# Altium project T-Type Converter.PrjPcb (part 2 of 2)

## Sheet Switches.SchDoc
size A2
Used 3 times, as channels A, B, C. Parts and nets are listed once, with the designators drawn on the sheet.
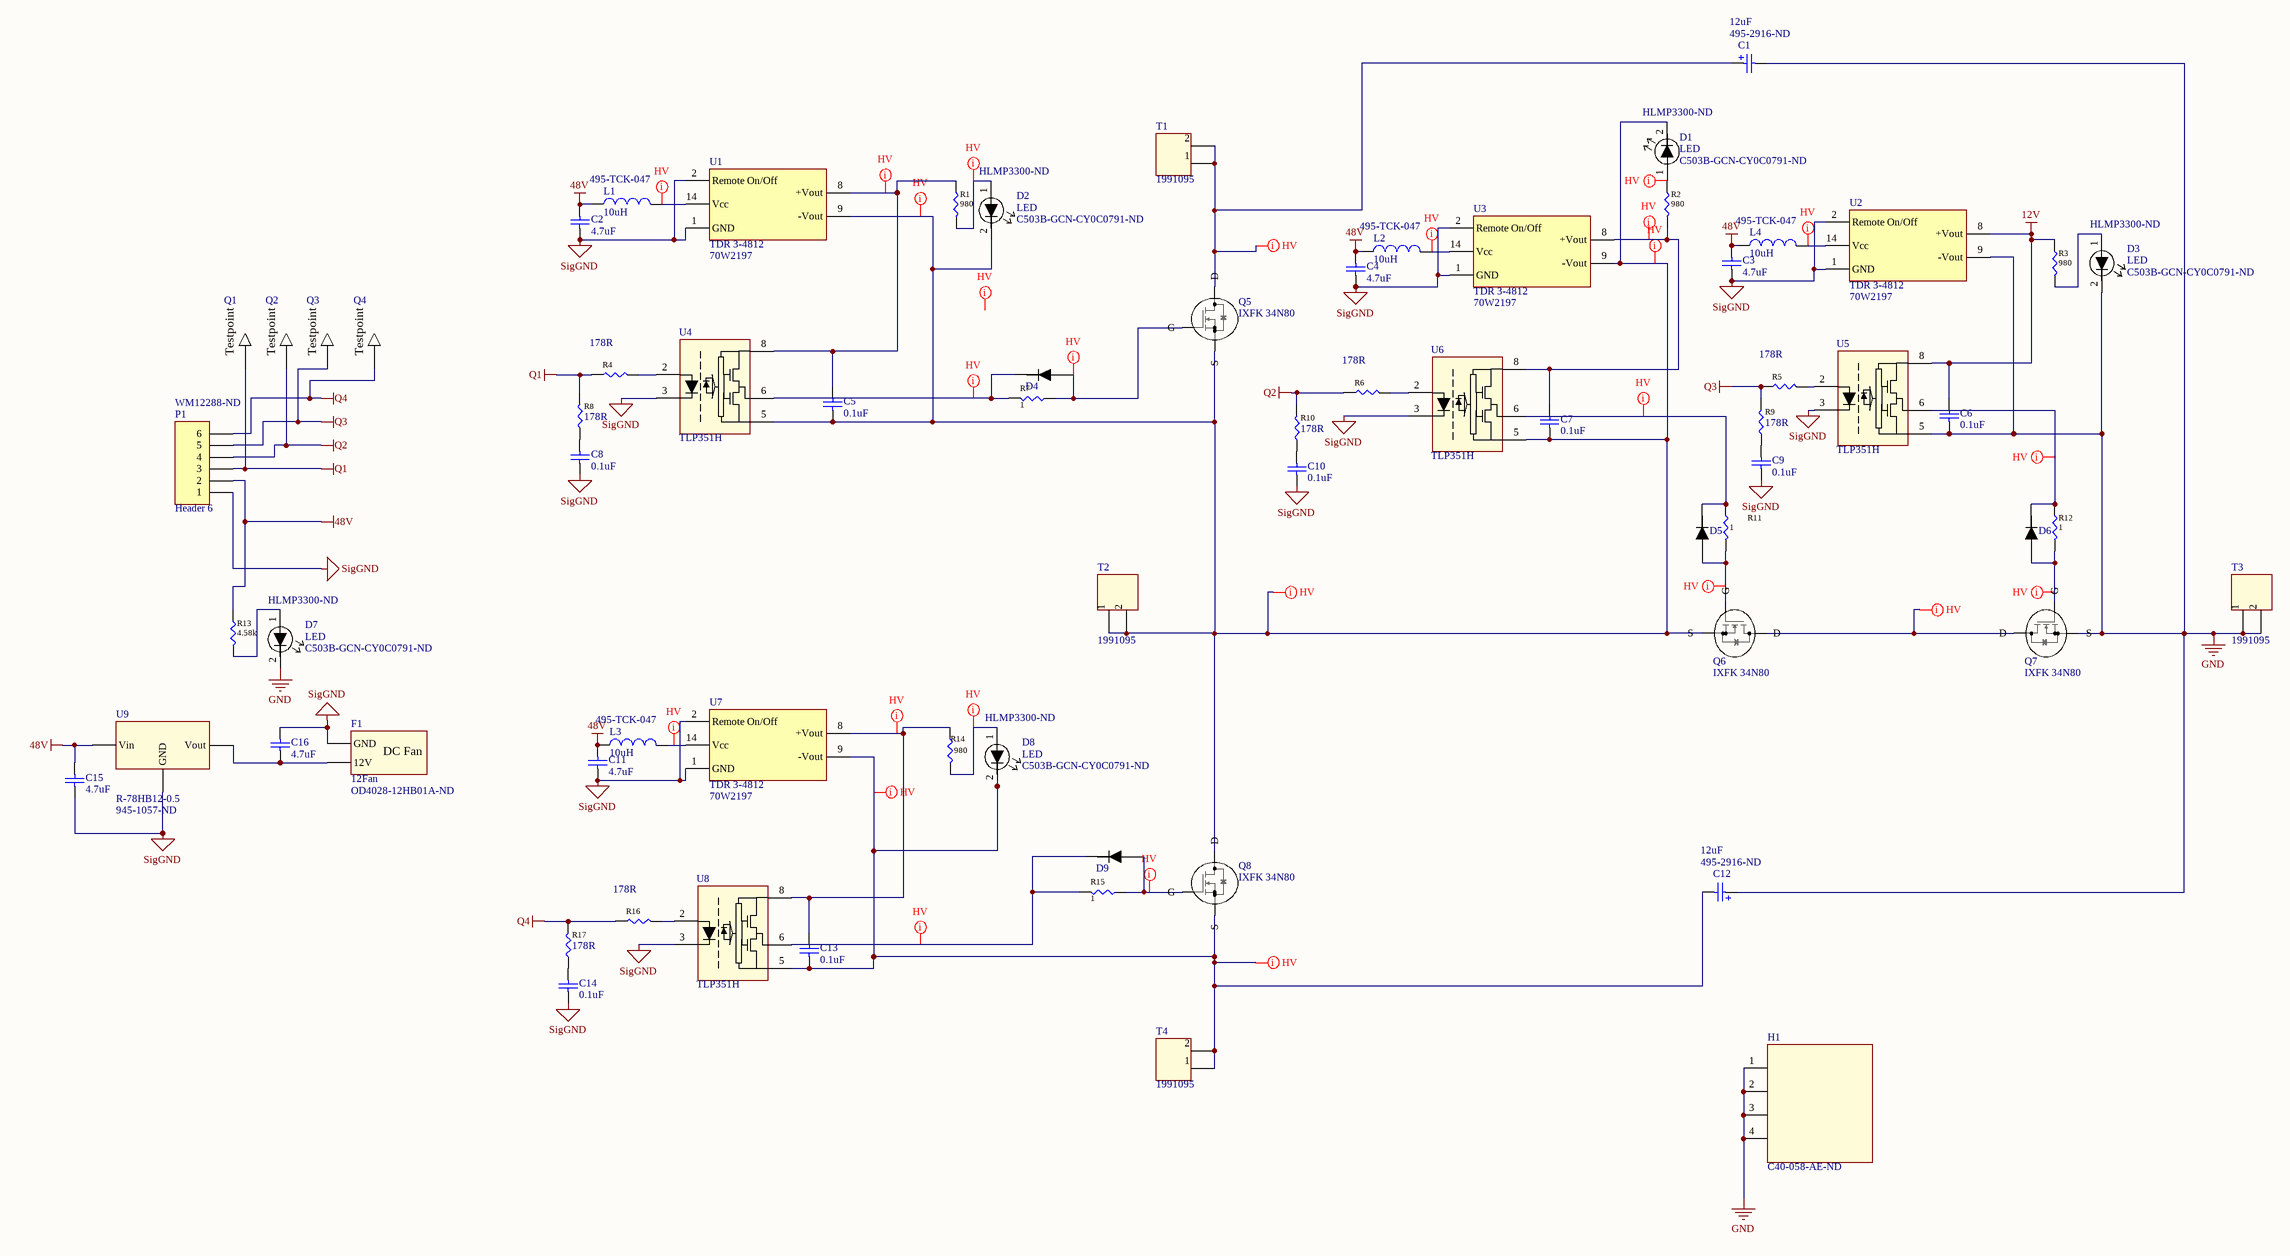
[diagram p2: Switches.SchDoc]

### Parts
C1  Supplier Part Number 1: 495-2916-ND  Capacitance: 12uF  [B32674D3126K000]  (hidden comment: Cap Pol1)
C2  value 4.7uF  [C4532]  (hidden comment: Cap)
C3  value 4.7uF  [C4532]  (hidden comment: Cap)
C4  value 4.7uF  [C4532]  (hidden comment: Cap)
C5  value 0.1uF  [R_1206]  (hidden comment: Cap)
C6  value 0.1uF  [R_1206]  (hidden comment: Cap)
C7  value 0.1uF  [R_1206]  (hidden comment: Cap)
C8  value 0.1uF  [Capacitor 0805 - duplicate]  (hidden comment: Cap)
C9  value 0.1uF  [Capacitor 0805 - duplicate]  (hidden comment: Cap)
C10  value 0.1uF  [Capacitor 0805 - duplicate]  (hidden comment: Cap)
C11  value 4.7uF  [C4532]  (hidden comment: Cap)
C12  Supplier Part Number 1: 495-2916-ND  Capacitance: 12uF  [B32674D3126K000]  (hidden comment: Cap Pol1)
C13  value 0.1uF  [R_1206]  (hidden comment: Cap)
C14  value 0.1uF  [Capacitor 0805 - duplicate]  (hidden comment: Cap)
C15  value 4.7uF  [C4532]  (hidden comment: Cap)
C16  value 4.7uF  [C4532]  (hidden comment: Cap)
D1  LED  Supplier Part Number 1: C503B-GCN-CY0C0791-ND  Supplier Part Number 2: HLMP3300-ND  [LED]
D2  LED  Supplier Part Number 1: C503B-GCN-CY0C0791-ND  Supplier Part Number 2: HLMP3300-ND  [LED]
D3  LED  Supplier Part Number 1: C503B-GCN-CY0C0791-ND  Supplier Part Number 2: HLMP3300-ND  [LED]
D4  1N4148  [DO-35_02]  (value not drawn)
D5  1N4148  [DO-35_02]  (value not drawn)
D6  1N4148  [DO-35_02]  (value not drawn)
D7  LED  Supplier Part Number 1: C503B-GCN-CY0C0791-ND  Supplier Part Number 2: HLMP3300-ND  [LED]
D8  LED  Supplier Part Number 1: C503B-GCN-CY0C0791-ND  Supplier Part Number 2: HLMP3300-ND  [LED]
D9  1N4148  [DO-35_02]  (value not drawn)
F1  12Fan  Supplier Part Number 1: OD4028-12HB01A-ND  [12V Fan]
H1  Supplier Part Number 1: C40-058-AE-ND  [Dual C40]  (hidden comment: Heatsink)
L1  value 10uH  Supplier Part Number 1: 495-TCK-047  [TCK-047]  (hidden comment: Inductor)
L2  value 10uH  Supplier Part Number 1: 495-TCK-047  [TCK-047]  (hidden comment: Inductor)
L3  value 10uH  Supplier Part Number 1: 495-TCK-047  [TCK-047]  (hidden comment: Inductor)
L4  value 10uH  Supplier Part Number 1: 495-TCK-047  [TCK-047]  (hidden comment: Inductor)
P1  Header 6  Supplier Part Number 1: WM12288-ND  [3.00mm Male Header]
Q1  Testpoint  [Testpoint]  (value not drawn)
Q2  Testpoint  [Testpoint]  (value not drawn)
Q3  Testpoint  [Testpoint]  (value not drawn)
Q4  Testpoint  [Testpoint]  (value not drawn)
Q5  IXFK 34N80  [TO-247]
Q6  IXFK 34N80  [TO-247]
Q7  IXFK 34N80  [TO-247]
Q8  IXFK 34N80  [TO-247]
R1  980  [R_1206]
R2  980  [R_1206]
R3  980  [R_1206]
R4  Resistance: 178R  [R_1206]
R5  Resistance: 178R  [R_1206]
R6  Resistance: 178R  [R_1206]
R7  1  [R_1206]
R8  Resistance: 178R  [R_1206]
R9  Resistance: 178R  [R_1206]
R10  Resistance: 178R  [R_1206]
R11  1  [R_1206]
R12  1  [R_1206]
R13  4.58k  [R_1206]
R14  980  [R_1206]
R15  1  [R_1206]
R16  Resistance: 178R  [R_1206]
R17  Resistance: 178R  [R_1206]
T1  1991095  [Terminal Pad]
T2  1991095  [Terminal Pad]
T3  1991095  [Terminal Pad]
T4  1991095  [Terminal Pad]
U1  TDR 3-4812  Supplier Part Number 1: 70W2197  [PID DC-DC Converter - duplicate]
U2  TDR 3-4812  Supplier Part Number 1: 70W2197  [PID DC-DC Converter - duplicate]
U3  TDR 3-4812  Supplier Part Number 1: 70W2197  [PID DC-DC Converter - duplicate]
U4  TLP351H  [11-10C4S]
U5  TLP351H  [11-10C4S]
U6  TLP351H  [11-10C4S]
U7  TDR 3-4812  Supplier Part Number 1: 70W2197  [PID DC-DC Converter - duplicate]
U8  TLP351H  [11-10C4S]
U9  R-78HB12-0.5  Supplier Part Number 1: 945-1057-ND  [R-78HB12-0.5 Footprint]

### Nets
12V: C6.2 R3.2 U2.8(+Vout) U5.8
48V: C2.2 C3.2 C4.2 C11.2 C15.2 L1.1 L2.1 L3.1 L4.1 P1.2 R13.2 U9.1(Vin)
GND: C1.2 C6.1 C12.1 D3.2(Cathode) D7.2(Cathode) H1.1 H1.2 H1.3 H1.4 Q7.3(S) T3.1 T3.2 U2.9(-Vout) U5.5
Q1: P1.3 Q1.1 R4.2 R8.1
Q2: P1.4 Q2.1 R6.2 R10.1
Q3: P1.5 Q3.1 R5.2 R9.1
Q4: P1.6 Q4.1 R16.2 R17.1
SigGND: C2.1 C3.1 C4.1 C8.1 C9.1 C10.1 C11.1 C14.1 C15.1 C16.2 F1.2(GND) P1.1 U1.1(GND) U1.2(Remote_On/Off) U2.1(GND) U2.2(Remote_On/Off) U3.1(GND) U3.2(Remote_On/Off) U4.3 U5.3 U6.3 U7.1(GND) U7.2(Remote_On/Off) U8.3 U9.2(GND)
NetC1_1: C1.1 Q5.2(D) T1.1 T1.2
NetC5_1: C5.1 C7.1 D1.2(Cathode) D2.2(Cathode) Q5.3(S) Q6.3(S) Q8.2(D) T2.1 T2.2 U1.9(-Vout) U3.9(-Vout) U4.5 U6.5
NetC5_2: C5.2 R1.2 U1.8(+Vout) U4.8
NetC7_2: C7.2 R2.1 U3.8(+Vout) U6.8
NetC8_2: C8.2 R8.2
NetC9_2: C9.2 R9.2
NetC10_2: C10.2 R10.2
NetC12_2: C12.2 C13.1 D8.2(Cathode) Q8.3(S) T4.1 T4.2 U7.9(-Vout) U8.5
NetC13_2: C13.2 R14.2 U7.8(+Vout) U8.8
NetC14_2: C14.2 R17.2
NetC16_1: C16.1 F1.1(12V) U9.3(Vout)
NetD1_1: D1.1(Anode) R2.2
NetD2_1: D2.1(Anode) R1.1
NetD3_1: D3.1(Anode) R3.1
NetD4_1: D4.1(Cathode) R7.1 U4.6
NetD4_2: D4.2(Anode) Q5.1(G) R7.2
NetD5_1: D5.1(Cathode) R11.2 U6.6
NetD5_2: D5.2(Anode) Q6.1(G) R11.1
NetD6_1: D6.1(Cathode) R12.2 U5.6
NetD6_2: D6.2(Anode) Q7.1(G) R12.1
NetD7_1: D7.1(Anode) R13.1
NetD8_1: D8.1(Anode) R14.1
NetD9_1: D9.1(Cathode) R15.1 U8.6
NetD9_2: D9.2(Anode) Q8.1(G) R15.2
NetL1_2: L1.2 U1.14(Vcc)
NetL2_2: L2.2 U3.14(Vcc)
NetL3_2: L3.2 U7.14(Vcc)
NetL4_2: L4.2 U2.14(Vcc)
NetQ6_2: Q6.2(D) Q7.2(D)
NetR4_1: R4.1 U4.2
NetR5_1: R5.1 U5.2
NetR6_1: R6.1 U6.2
NetR16_1: R16.1 U8.2

### Channels
A: designators C1=C27_A C2=C28_A C3=C3_A C4=C31_A C5=C5_A C6=C6_A C7=C7_A C8=C8_A C9=C9_A C10=C10_A C11=C36_A C12=C38_A C13=C13_A C14=C14_A C15=C15_A C16=C16_A D1=D1_A#1 D2=D2_A#1 D3=D3_A#1 D4=D1_A#2 D5=D2_A#2 D6=D3_A#2 D7=D7_A D8=D8_A D9=D4_A F1=F1_A H1=H1_A L1=L3_A L2=L5_A L3=L6_A L4=L4_A P1=P1_A Q1=Q1_A#2 Q2=Q2_A#1 Q3=Q3_A#1 Q4=Q4_A#1 Q5=Q1_A#1 Q6=Q2_A#2 Q7=Q3_A#2 Q8=Q4_A#2 R1=R1_A R2=R2_A R3=R3_A R4=R4_A R5=R5_A R6=R6_A R7=R13_A#1 R8=R8_A R9=R9_A R10=R10_A R11=R17_A#1 R12=R18_A R13=R13_A#2 R14=R14_A R15=R19_A R16=R16_A R17=R17_A#2 T1=T1_A T2=T2_A T3=T3_A T4=T4_A U1=U13_A U2=U2_A U3=U15_A U4=U4_A U5=U5_A U6=U6_A U7=U19_A U8=U8_A U9=U9_A
B: designators C1=C27_B C2=C28_B C3=C3_B C4=C31_B C5=C5_B C6=C6_B C7=C7_B C8=C8_B C9=C9_B C10=C10_B C11=C36_B C12=C38_B C13=C13_B C14=C14_B C15=C15_B C16=C16_B D1=D1_B#1 D2=D2_B#1 D3=D3_B#1 D4=D1_B#2 D5=D2_B#2 D6=D3_B#2 D7=D7_B D8=D8_B D9=D4_B F1=F1_B H1=H1_B L1=L3_B L2=L5_B L3=L6_B L4=L4_B P1=P1_B Q1=Q1_B#2 Q2=Q2_B#1 Q3=Q3_B#1 Q4=Q4_B#1 Q5=Q1_B#1 Q6=Q2_B#2 Q7=Q3_B#2 Q8=Q4_B#2 R1=R1_B R2=R2_B R3=R3_B R4=R4_B R5=R5_B R6=R6_B R7=R13_B#1 R8=R8_B R9=R9_B R10=R10_B R11=R17_B#1 R12=R18_B R13=R13_B#2 R14=R14_B R15=R19_B R16=R16_B R17=R17_B#2 T1=T1_B T2=T2_B T3=T3_B T4=T4_B U1=U13_B U2=U2_B U3=U15_B U4=U4_B U5=U5_B U6=U6_B U7=U19_B U8=U8_B U9=U9_B
C: designators C1=C27_C C2=C28_C C3=C3_C C4=C31_C C5=C5_C C6=C6_C C7=C7_C C8=C8_C C9=C9_C C10=C10_C C11=C36_C C12=C38_C C13=C13_C C14=C14_C C15=C15_C C16=C16_C D1=D1_C#1 D2=D2_C#1 D3=D3_C#1 D4=D1_C#2 D5=D2_C#2 D6=D3_C#2 D7=D7_C D8=D8_C D9=D4_C F1=F1_C H1=H1_C L1=L3_C L2=L5_C L3=L6_C L4=L4_C P1=P1_C Q1=Q1_C#2 Q2=Q2_C#1 Q3=Q3_C#1 Q4=Q4_C#1 Q5=Q1_C#1 Q6=Q2_C#2 Q7=Q3_C#2 Q8=Q4_C#2 R1=R1_C R2=R2_C R3=R3_C R4=R4_C R5=R5_C R6=R6_C R7=R13_C#1 R8=R8_C R9=R9_C R10=R10_C R11=R17_C#1 R12=R18_C R13=R13_C#2 R14=R14_C R15=R19_C R16=R16_C R17=R17_C#2 T1=T1_C T2=T2_C T3=T3_C T4=T4_C U1=U13_C U2=U2_C U3=U15_C U4=U4_C U5=U5_C U6=U6_C U7=U19_C U8=U8_C U9=U9_C

### Layout directives
net class HV: (no net found under the mark), NetC5_A_1, NetC5_A_2, NetC7_A_2, NetC13_A_1, NetC13_A_2, NetC27_A_1, NetD1_A#1_1, NetD1_A#2_1, NetD1_A#2_2, NetD2_A#1_1, NetD2_A#2_1, NetD2_A#2_2, NetD3_A#2_1, NetD3_A#2_2, NetD4_A_1, NetD4_A_2, NetD8_A_1, NetL3_A_2, NetL4_A_2, NetL5_A_2, NetL6_A_2, NetQ2_A#2_2

### Notes on the sheet
- (in symbol 12Fan) DC Fan

### Library data of the parts
C1 C12 = Cap Pol1: Polarized Capacitor (Radial); Manufacturer: TDK EPCOS; Dielectric Material: Polypropylene; Tolerance: 10%; ESR (Equivalent Series Resistance): 4mR; Dielectric: PP; Lead Diameter: 0.8mm; Lead Length: 6mm; Published: 8-Jun-2000; LatestRevisionDate: 17-Jul-2002; LatestRevisionNote: Re-released for DXP Platform.; PackageReference: RB7.6-15; Publisher: Altium Limited; PackageDescription: Polarized Capacitor (Radial); 2 Leads; Supplier 1: Digi-Key; Manufacturer Part Number: B32674D3126K000; Stock 1: 17158; Pricing 1: 1=5.33, 10=4.799, 100=3.6259, 500=2.9861, 1000=2.7728, 2500=2.7195 (USD); Case/Package: Radial; Min Operating Temperature: -40°C; Max Operating Temperature: 100°C; Packaging: Bulk; Termination: Radial; Length: 31.5mm; Height: 36.5mm; Lead Pitch: 27.5mm; Depth: 22mm; ComponentLink1URL: http://components.arrow.com/part/dataview/0323_01884664; ComponentLink1Description: http://components.arrow.com/part/dataview/0323_01884664
C2-C4 C11 C15 C16 = Cap: Capacitor; Manufacturer: TDK; Manufacturer Part Number: CGA8N3X7S2A475K230KB; Tolerance: 10%; Voltage Rating: 100V; Dielectric: X7S; Published: 8-Jun-2000; LatestRevisionDate: 17-Jul-2002; LatestRevisionNote: Re-released for DXP Platform.; PackageReference: RAD-0.3; Publisher: Altium Limited; PackageDescription: Radial Cap, Thru-Hole; 2 Leads; 0.3 in Pin Spacing; Supplier 1: Digi-Key; Supplier Part Number 1: 445-7923-1-ND; Stock 1: 236; Pricing 1: 1=1.92, 10=1.518, 100=1.1385 (USD); Case/Package: 1812; Weight: 0.000952oz; Case Code (Metric): 4532; Case Code (Imperial): 1812; Min Operating Temperature: -55°C; Max Operating Temperature: 125°C; Packaging: Tape and Reel; Capacitance: 4.7uF; Termination: SMD/SMT; Package Quantity: 1; Voltage Rating (DC): 100V; Composition: Ceramic; Length: 4.5mm; Height: 1.6mm; Width: 0.126inch; Thickness: 0.091inch; Depth: 3.2mm; REACH SVHC: No SVHC; ComponentLink1URL: https://datasheet.ciiva.com/24217/cga8n3x7s2a475k230kb-266118-24217101.pdf; ComponentLink1Description: https://datasheet.ciiva.com/24217/cga8n3x7s2a475k230kb-266118-24217101.pdf
C5-C10 C13 C14 = Cap: Capacitor; Published: 8-Jun-2000; LatestRevisionDate: 17-Jul-2002; LatestRevisionNote: Re-released for DXP Platform.; PackageReference: RAD-0.3; Publisher: Altium Limited; PackageDescription: Radial Cap, Thru-Hole; 2 Leads; 0.3 in Pin Spacing
D1-D3 D7 D8 = LED: Manufacturer: Cree; Manufacturer Part Number: C503B-GCN-CY0C0791; Colour: Green; Lens Colour: Clear,Colorless; Viewing Angle: 30°; Lens Style: Dome,Round; Luminous Intensity: 12.5cd; Forward Voltage: 3.2V; Wavelength: 535nm; Forward Current: 20mA; Lens Transparency: Clear; Dominant Wavelength: 527nm; Number of Elements: 1; Power Dissipation: 120mW; Supplier 1: Digi-Key; Stock 1: 14930; Pricing 1: 1=0.24, 10=0.227, 100=0.2098, 1000=0.1877, 50000=0.1743 (USD); Mount: Through Hole; Case/Package: Radial; Number of Pins: 2; Weight: 0.01lb; Min Operating Temperature: -40°C; Max Operating Temperature: 95°C; Packaging: Bulk; Illumination Colour: Green; Test Current: 20mA; Number of LEDs: 1; Length: 5.8mm; Height: 8.8mm; Depth: 5.8mm; Width: 0.5inch; Radiation Hardening: No; REACH SVHC: Unknown; ComponentLink1URL: https://datasheet.ciiva.com/2111/c503b+bas+ban+bcs+bcn+gas+gan+gcs+gcn+1094-2111680.pdf; ComponentLink1Description: https://datasheet.ciiva.com/2111/c503b+bas+ban+bcs+bcn+gas+gan+gcs+gcn+1094-2111680.pdf; ComponentLink2URL: https://datasheet.ciiva.com/15210/getdatasheetpartid-314292-15210341.pdf; ComponentLink2Description: https://datasheet.ciiva.com/15210/getdatasheetpartid-314292-15210341.pdf; ComponentLink3URL: https://datasheet.ciiva.com/18319/25-4952-18319333.pdf; ComponentLink3Description: https://datasheet.ciiva.com/18319/25-4952-18319333.pdf; ComponentLink4URL: https://datasheet.ciiva.com/1331/1604976-1331801.pdf; ComponentLink4Description: https://datasheet.ciiva.com/1331/1604976-1331801.pdf; ComponentLink5URL: https://datasheet.ciiva.com/8076/c503bbasbanbcsbcngasgangcsgcn1094-8076249.pdf; ComponentLink5Description: https://datasheet.ciiva.com/8076/c503bbasbanbcsbcngasgangcsgcn1094-8076249.pdf; Supplier 2: Digi-Key; Stock 2: 0; Package Quantity: 5000; Lead Free: Lead Free; ComponentLink6URL: https://datasheet.ciiva.com/2121/hlmp-3300-01-15-16-2121755.pdf; ComponentLink6Description: https://datasheet.ciiva.com/2121/hlmp-3300-01-15-16-2121755.pdf
D4-D6 D9 = 1N4148: Diode; Manufacturer: Fairchild Semiconductor; Forward Voltage: 1V; Reverse Recovery Time: 4ns; Element Configuration: Single; Polarity: Standard; Current Rating: 200mA; Capacitance: 4pF; Voltage Rating (DC): 100V; Peak Non-Repetitive Surge Current: 4A; Max Forward Surge Current (Ifsm): 1A; Max Power Dissipation: 500mW; Peak Reverse Current: 5uA; Outside Diameter: 1.85mm; Supplier 1: Digi-Key; Manufacturer Part Number: 1N4148; Stock 1: 0; Pricing 1: 25=4 (USD); Mount: Through Hole; Number of Pins: 2; Weight: 0.01lb; Contact Plating: Tin; Min Operating Temperature: -65°C; Max Operating Temperature: 175°C; Packaging: Bulk; Output Current: 200mA; Forward Current: 200mA; Max Repetitive Reverse Voltage (Vrrm): 100V; Package Quantity: 2000; Recovery Time: 4ns; Max Surge Current: 4A; Reverse Voltage (DC): 100V; Average Rectified Current: 200mA; Power Dissipation: 500mW; Diameter: 1.91mm; Length: 4.56mm; Height: 4.56mm; Width: 1.91mm; Radiation Hardening: No; Lead Free: Lead Free; REACH SVHC: No SVHC; ComponentLink1URL: https://datasheet.ciiva.com/910/1n914-910546.pdf; ComponentLink1Description: https://datasheet.ciiva.com/910/1n914-910546.pdf; ComponentLink2URL: https://datasheet.ciiva.com/1242/1716967-1242233.pdf; ComponentLink2Description: https://datasheet.ciiva.com/1242/1716967-1242233.pdf; ComponentLink3URL: https://datasheet.ciiva.com/3304/fdll914b-3304217.pdf; ComponentLink3Description: https://datasheet.ciiva.com/3304/fdll914b-3304217.pdf; ComponentLink4URL: https://datasheet.ciiva.com/25951/fdll914b-25951516.pdf; ComponentLink4Description: https://datasheet.ciiva.com/25951/fdll914b-25951516.pdf; ComponentLink5URL: https://datasheet.ciiva.com/27049/743285-27049708.pdf; ComponentLink5Description: https://datasheet.ciiva.com/27049/743285-27049708.pdf; ComponentLink6URL: https://datasheet.ciiva.com/16740/1n4148-16740829.pdf; ComponentLink6Description: https://datasheet.ciiva.com/16740/1n4148-16740829.pdf; Supplier Part Number 1: 1N4148-DIE-ND
F1 = 12Fan: Manufacturer: Knight Electronics Orion; Manufacturer Part Number: OD4028-12HB01A; Current Rating: 200mA; Airflow: 12CFM; RPM: 8800RPM; Bearing Type: Ball; Voltage Rating: 12V; Power Consumption: 2.64W; Noise Level: 37dB; Noise: 37dBA; Supplier 1: Digi-Key; Stock 1: 0; Pricing 1: 520=10.5105 (USD); Case/Package: Axial; Min Operating Temperature: -4°C; Max Operating Temperature: 176°C; Package Quantity: 40; Termination: 3 Wire Leads; Operating Supply Voltage: 12V; Height: 40mm; Width: 28mm; Depth: 28mm; Lead Free: Lead Free; ComponentLink1URL: https://datasheet.ciiva.com/1001/part-number-construction-guide-1001713.pdf; ComponentLink1Description: https://datasheet.ciiva.com/1001/part-number-construction-guide-1001713.pdf; ComponentLink2URL: https://datasheet.ciiva.com/16472/od4028-16472707.pdf; ComponentLink2Description: https://datasheet.ciiva.com/16472/od4028-16472707.pdf
H1 = C-40 Heatsink: Dual C-40 Heatsink; Manufacturer: Ohmite; Manufacturer Part Number: C40-058-AE; Shape: Fins,Rectangular; Supplier 1: Digi-Key; Stock 1: 482; Pricing 1: 1=6.75, 10=6.57, 25=6.2052, 50=5.84, 100=5.475, 250=5.11, 500=4.745, 1000=4.6538 (USD); Mount: Clip; Case/Package: TO-247; Colour: Black,Silver; Material: Aluminium; Package Quantity: 1; Packaging: Bulk; Length: 58mm; Height: 43.8mm; Width: 32mm; Height Off Base: 1.26inch; REACH SVHC: Unknown; ComponentLink1URL: https://datasheet.ciiva.com/24006/sink-c40-253256-24006193.pdf; ComponentLink1Description: https://datasheet.ciiva.com/24006/sink-c40-253256-24006193.pdf; ComponentLink2URL: https://datasheet.ciiva.com/17118/70290407-17118119.pdf; ComponentLink2Description: https://datasheet.ciiva.com/17118/70290407-17118119.pdf; ComponentLink3URL: https://datasheet.ciiva.com/46412/sink-c40-46412139.pdf; ComponentLink3Description: https://datasheet.ciiva.com/46412/sink-c40-46412139.pdf
L1-L4 = Inductor: Manufacturer: Traco Power; Code_IEC: 1005; Tolerance: 20%; DC Resistance (DCR): 100mR; Test Frequency: 1KHz; DC Current: 1.44A; Published: 8-Jun-2000; LatestRevisionDate: 29-May-2009; LatestRevisionNote: IPC-7351 Footprint Added.; PackageReference: 0402-A; Publisher: Altium Limited; PackageDescription: Chip Inductor; Code_JEITA: 0402; Supplier 1: Mouser; Manufacturer Part Number: TCK-047; Stock 1: 23; Pricing 1: 1=2.52, 10=2.48, 50=2.33, 100=2.33, 1000=2.33, 10000=2.33 (USD); Case/Package: SMD/SMT; Military Standard: Not; Inductance: 10uh; Impedance: 100mR; Current Rating: 1.44A; Length: 6.1mm; Depth: 5.5mm; REACH SVHC: No SVHC; ComponentLink1URL: http://components.arrow.com/part/dataview/0323_04115114; ComponentLink1Description: http://components.arrow.com/part/dataview/0323_04115114; ComponentLink2URL: http://www.farnell.com/datasheets/2062539.pdf; ComponentLink2Description: http://www.farnell.com/datasheets/2062539.pdf
P1 = Header 6: Header, 6-Pin; Manufacturer: Molex; Manufacturer Part Number: 0559320610; Number of Positions: 6; Connector Type: Male Pin; Pitch: 2mm; LatestRevisionDate: 17-Jul-2002; LatestRevisionNote: Re-released for DXP Platform.; Publisher: Altium Limited; Supplier 1: Digi-Key; Stock 1: 5638; Pricing 1: 1=0.53, 10=0.497, 100=0.3811, 500=0.3314, 1000=0.2734, 5000=0.2403, 10000=0.2237 (USD); Mount: Through Hole; Housing Material: Polyester; Contact Plating: Tin; Colour: Natural; Housing Colour: Natural; Min Operating Temperature: -25°C; Max Operating Temperature: 85°C; Packaging: Tray; Number of Rows: 1; Termination: Solder; Orientation: Straight; Package Quantity: 3200; Number of Contacts: 6; Fastening Type: Latch; Length: 16mm; Depth: 6.7mm; Contact Mating Length: 0.144inch; ComponentLink1URL: https://datasheet.ciiva.com/2943/559320310-sd-2943088.pdf; ComponentLink1Description: https://datasheet.ciiva.com/2943/559320310-sd-2943088.pdf; ComponentLink2URL: https://datasheet.ciiva.com/10086/0559320610-pcb-headers-10086524.pdf; ComponentLink2Description: https://datasheet.ciiva.com/10086/0559320610-pcb-headers-10086524.pdf
Q5-Q8 = IXFK 34N80: MOSFET 34A; Manufacturer: IXYS; Rise Time: 45ns; Rds On Max: 240mR; Input Capacitance: 7.5nF; Recovery Time: 250ns; Drain to Source Breakdown Voltage: 800V; Fall Time: 40ns; Power Dissipation: 560W; Turn-Off Delay Time: 100ns; Element Configuration: Single; Gate to Source Voltage (Vgs): 20V; Supplier 1: Digikey; Manufacturer Part Number: IXFK34N80; Stock 1: 25; Pricing 1: 1=22.64, 10=20.94, 25=19.2424, 100=17.884, 250=16.4126 (USD); Case/Package: TO-264-3; Min Operating Temperature: -55°C; Max Operating Temperature: 150°C; Package Quantity: 25; Packaging: Rail/Tube; Continuous Drain Current (ID): 34A; Drain to Source Resistance: 240mR; Drain to Source Voltage (Vdss): 800V; Max Power Dissipation: 560W; Current Rating: 34A; Voltage Rating (DC): 800V; Lead Free: Lead Free; ComponentLink1URL: https://datasheet.ciiva.com/4446/98560-63299-4446514.pdf; ComponentLink1Description: https://datasheet.ciiva.com/4446/98560-63299-4446514.pdf; ComponentLink2URL: https://datasheet.ciiva.com/16298/98560-16298076.pdf; ComponentLink2Description: https://datasheet.ciiva.com/16298/98560-16298076.pdf; ComponentLink3URL: https://datasheet.ciiva.com/940/98560-940430.pdf; ComponentLink3Description: https://datasheet.ciiva.com/940/98560-940430.pdf; ComponentLink4URL: https://datasheet.ciiva.com/14110/tb612985-e-14110030.pdf; ComponentLink4Description: https://datasheet.ciiva.com/14110/tb612985-e-14110030.pdf; ComponentLink5URL: https://datasheet.ciiva.com/26791/ixfk34n80-26791415.pdf; ComponentLink5Description: https://datasheet.ciiva.com/26791/ixfk34n80-26791415.pdf; Supplier Part Number 1: IXFK34N80-ND
R1-R3 R7 R11-R15 = RES_SMD1: RES SMD 1% 1/4W 1206; Manufacturer: Panasonic Electronic Components; Manufacturer Part Number: ERJ-8ENF9101V; Power (Watts): 0.25W, 1/4W; Temperature Coefficient: ±100ppm/°C; Supplier 1: Digi-Key; RoHS: RoHS Compliant; Category: Resistors; Stock 1: 17632; Pricing 1: 1=0.15, 50=0.0424, 100=0.0313, 250=0.02384, 500=0.01908, 1000=0.01404 (CAD); Packaging: Digi-Reel®; Part Status: Active; Tolerance: ±1%; Composition: Thick Film; Features: Automotive AEC-Q200; Operating Temperature: -55°C ~ 155°C; Package / Case: 1206 (3216 Metric); Supplier Device Package: 1206; Size / Dimension: 0.126" L x 0.063" W (3.20mm x 1.60mm); Height: 0.028" (0.70mm); Number of Terminations: 2; Failure Rate: -; ComponentLink1URL: http://industrial.panasonic.com/www-cgi/jvcr13pz.cgi?E+PZ+3+AOA0002+ERJ8ENF9101V+7+WW; ComponentLink1Description: http://industrial.panasonic.com/www-cgi/jvcr13pz.cgi?E+PZ+3+AOA0002+ERJ8ENF9101V+7+WW; Supplier Part Number 1: P9.10KFDKR-ND
  R1-R3 R14: Value: 980
  R7 R11 R12 R15: Value: 1
  R13: Value: 4.58k
R4-R6 R8-R10 R16 R17 = RES_SMD1: RES SMD 1% 1/4W 1206; Manufacturer: Panasonic ECG; Manufacturer Part Number: ERJ-8ENF1780V; Temperature Coefficient: 100ppm/°C; Power Rating: 250mW; Voltage Rating: 200V; Supplier 1: Digi-Key; Supplier Part Number 1: P178FCT-ND; Stock 1: 69740; Pricing 1: 1=0.11, 10=0.097, 100=0.0373, 1000=0.0164, 2500=0.0142 (USD); Mount: Surface Mount; Case/Package: 1206; Contact Plating: Tin; Case Code (Imperial): 1206; Case Code (Metric): 3216; Min Operating Temperature: -55°C; Max Operating Temperature: 155°C; Tolerance: 1%; Composition: Thick Film; Packaging: Tape and Reel; Package Quantity: 5000; Termination: SMD/SMT; Number of Terminations: 2; Military Standard: Not; Max Power Dissipation: 250mW; Voltage Rating (DC): 200V; Length: 3.2mm; Height: 0.028inch; Width: 1.6mm; Depth: 1.6mm; Radiation Hardening: No; REACH SVHC: Yes; Lead Free: Contains Lead; ComponentLink1URL: https://datasheet.ciiva.com/46444/1678782-46444661.pdf; ComponentLink1Description: https://datasheet.ciiva.com/46444/1678782-46444661.pdf; ComponentLink2URL: https://datasheet.ciiva.com/17207/aoa0000ce2-17207240.pdf; ComponentLink2Description: https://datasheet.ciiva.com/17207/aoa0000ce2-17207240.pdf; ComponentLink3URL: https://datasheet.ciiva.com/24071/aoa0000ce2-24071720.pdf; ComponentLink3Description: https://datasheet.ciiva.com/24071/aoa0000ce2-24071720.pdf; ComponentLink4URL: https://datasheet.ciiva.com/30060/aoa0000ce2-30060360.pdf; ComponentLink4Description: https://datasheet.ciiva.com/30060/aoa0000ce2-30060360.pdf; ComponentLink5URL: https://datasheet.ciiva.com/22674/1678782-22674332.pdf; ComponentLink5Description: https://datasheet.ciiva.com/22674/1678782-22674332.pdf; ComponentLink6URL: https://datasheet.ciiva.com/22741/1678782-22741180.pdf; ComponentLink6Description: https://datasheet.ciiva.com/22741/1678782-22741180.pdf
T1-T4 = Terminal Block 2: 2 way terminal block; Manufacturer: Phoenix Contact; Colour: Green; Number of Contacts: 2; Wire Gauge (Max): 24AWG; Wire Gauge (Min): 12AWG; Voltage Rating: 400V; Current Rating: 24A; Number of Levels: 1; Current: 20A; Voltage: 300V; Pitch: 5mm; Approvals: UL; Supplier 1: Digi-Key; Manufacturer Part Number: 1991095; Stock 1: 1914; Pricing 1: 1=1.13, 10=1.078, 50=1.0486, 100=0.98, 250=0.9016, 500=0.833, 1000=0.7938, 2500=0.7448 (USD); Mount: Through Hole; Weight: 0.102294oz; Housing Colour: Green; Housing Material: Nylon; Termination: Screwless; Package Quantity: 100; Packaging: Bulk; Number of Poles: 2; Number of Positions Per Level: 2; Number of Positions: 2; Number of Rows: 1; Max Current Rating: 24A; Number of Circuits: 2; Orientation: Straight; Length: 11.4mm; Width: 14.4mm; Depth: 13.5mm; Lead Free: Lead Free; ComponentLink1URL: https://datasheet.ciiva.com/6752/1991095-6752880.pdf; ComponentLink1Description: https://datasheet.ciiva.com/6752/1991095-6752880.pdf; ComponentLink2URL: https://datasheet.ciiva.com/16051/1991095-16051374.pdf; ComponentLink2Description: https://datasheet.ciiva.com/16051/1991095-16051374.pdf; ComponentLink3URL: https://datasheet.ciiva.com/29222/774864-da-01-en-printklemme-1991095-100-st-29222380.pdf; ComponentLink3Description: https://datasheet.ciiva.com/29222/774864-da-01-en-printklemme-1991095-100-st-29222380.pdf; Supplier Part Number 1: 277-6267-ND
U1-U3 U7 = TDR 3-4812: 48V-12V Converter; Manufacturer: Traco Power; Manufacturer Part Number: TDR3-4812WI; Nominal Input Voltage: 48V; Output Voltage: 12V; Output Current: 250mA; Number of Outputs: 1; Efficiency: 81%; Min Input Voltage: 36V; Max Input Voltage: 75V; Min Input Voltage (DC): 18V; Isolation Voltage: 1.5kV; Max Output Power: 3W; Supplier 1: Newark; Stock 1: 0; Min Operating Temperature: -40°C; Max Operating Temperature: 85°C; Nominal Output Voltage: 12V; Max Output Current: 250mA; Max Input Voltage (DC): 75V; Voltage - Output 1: 12V; Current - Output 1: 250mA; Length: 18.9mm; Height: 8.7mm; Width: 12.8mm; Depth: 18.9mm; REACH SVHC: No SVHC; ComponentLink1URL: https://datasheet.ciiva.com/7625/1763545-7625255.pdf; ComponentLink1Description: https://datasheet.ciiva.com/7625/1763545-7625255.pdf; ComponentLink2URL: https://datasheet.ciiva.com/3356/tdr3wi-eng-tds-3356635.pdf; ComponentLink2Description: https://datasheet.ciiva.com/3356/tdr3wi-eng-tds-3356635.pdf; ComponentLink3URL: https://datasheet.ciiva.com/26336/157237-da-01-de-dc-dc-wandler-tdr-3-4812wi-26336242.pdf; ComponentLink3Description: https://datasheet.ciiva.com/26336/157237-da-01-de-dc-dc-wandler-tdr-3-4812wi-26336242.pdf
U4-U6 U8 = TLP351H: Photocoupler Driver; Manufacturer: Toshiba; Number of Channels: 1; Isolation Voltage: 3.75kV; Supplier 1: Newark; Manufacturer Part Number: TLP351H; Stock 1: 544; Case/Package: DIP; Number of Pins: 8; REACH SVHC: Unknown; ComponentLink1URL: http://www.farnell.com/datasheets/2017846.pdf; ComponentLink1Description: http://www.farnell.com/datasheets/2017846.pdf; Supplier Part Number 1: 78Y6824
U9 = R-78HB12-0.5: Manufacturer: Recom; Number of Outputs: 1; Efficiency: 94%; Max Power Dissipation: 6W; Max Output Voltage: 12V; Max Input Voltage: 72V; Min Input Voltage: 17V; Output Current: 500mA; Nominal Input Voltage: 48V; Isolation Voltage: 3kV; Isolation: Non-Isolated; Supplier 1: Digi-Key; Manufacturer Part Number: R-78HB12-0.5; Stock 1: 893; Pricing 1: 1=13.02, 5=12.92, 10=12.821, 25=12.624, 50=12.2296, 100=11.046, 250=10.8488, 500=10.6515 (USD); Mount: Through Hole,PCB; Case/Package: SIP; Weight: 4g; Min Operating Temperature: -40°C; Max Operating Temperature: 85°C; Packaging: Rail/Tube; Output Voltage: 12V; Min Input Voltage (DC): 17V; Max Input Voltage (DC): 72V; Max Output Current: 500mA; Nominal Output Voltage: 12V; Package Quantity: 42; Voltage - Output 1: 12V; Power Rating: 6W; Current - Output 1: 500mA; Output Power: 6W; Max Output Power: 6W; Length: 11.5mm; Height: 17.5mm; Width: 8.5mm; Depth: 11.5mm; Lead Free: Lead Free; REACH SVHC: No SVHC; ComponentLink1URL: https://datasheet.ciiva.com/2374/r-78hbxx-0-5-l-2374160.pdf; ComponentLink1Description: https://datasheet.ciiva.com/2374/r-78hbxx-0-5-l-2374160.pdf; ComponentLink2URL: https://datasheet.ciiva.com/4119/46860097s8433187n1223-4119049.pdf; ComponentLink2Description: https://datasheet.ciiva.com/4119/46860097s8433187n1223-4119049.pdf; ComponentLink3URL: https://datasheet.ciiva.com/3355/zlr-78hbxx-0-5-3355834.pdf; ComponentLink3Description: https://datasheet.ciiva.com/3355/zlr-78hbxx-0-5-3355834.pdf; ComponentLink4URL: https://datasheet.ciiva.com/16479/r-78hbxx-0-5-l-16479786.pdf; ComponentLink4Description: https://datasheet.ciiva.com/16479/r-78hbxx-0-5-l-16479786.pdf; ComponentLink5URL: https://datasheet.ciiva.com/11836/0900766b80aba023-11836814.pdf; ComponentLink5Description: https://datasheet.ciiva.com/11836/0900766b80aba023-11836814.pdf; ComponentLink6URL: https://datasheet.ciiva.com/29184/155001-da-01-en-dc-dc-wandler-29184381.pdf; ComponentLink6Description: https://datasheet.ciiva.com/29184/155001-da-01-en-dc-dc-wandler-29184381.pdf

## Sheet Signals.SchDoc
size A2
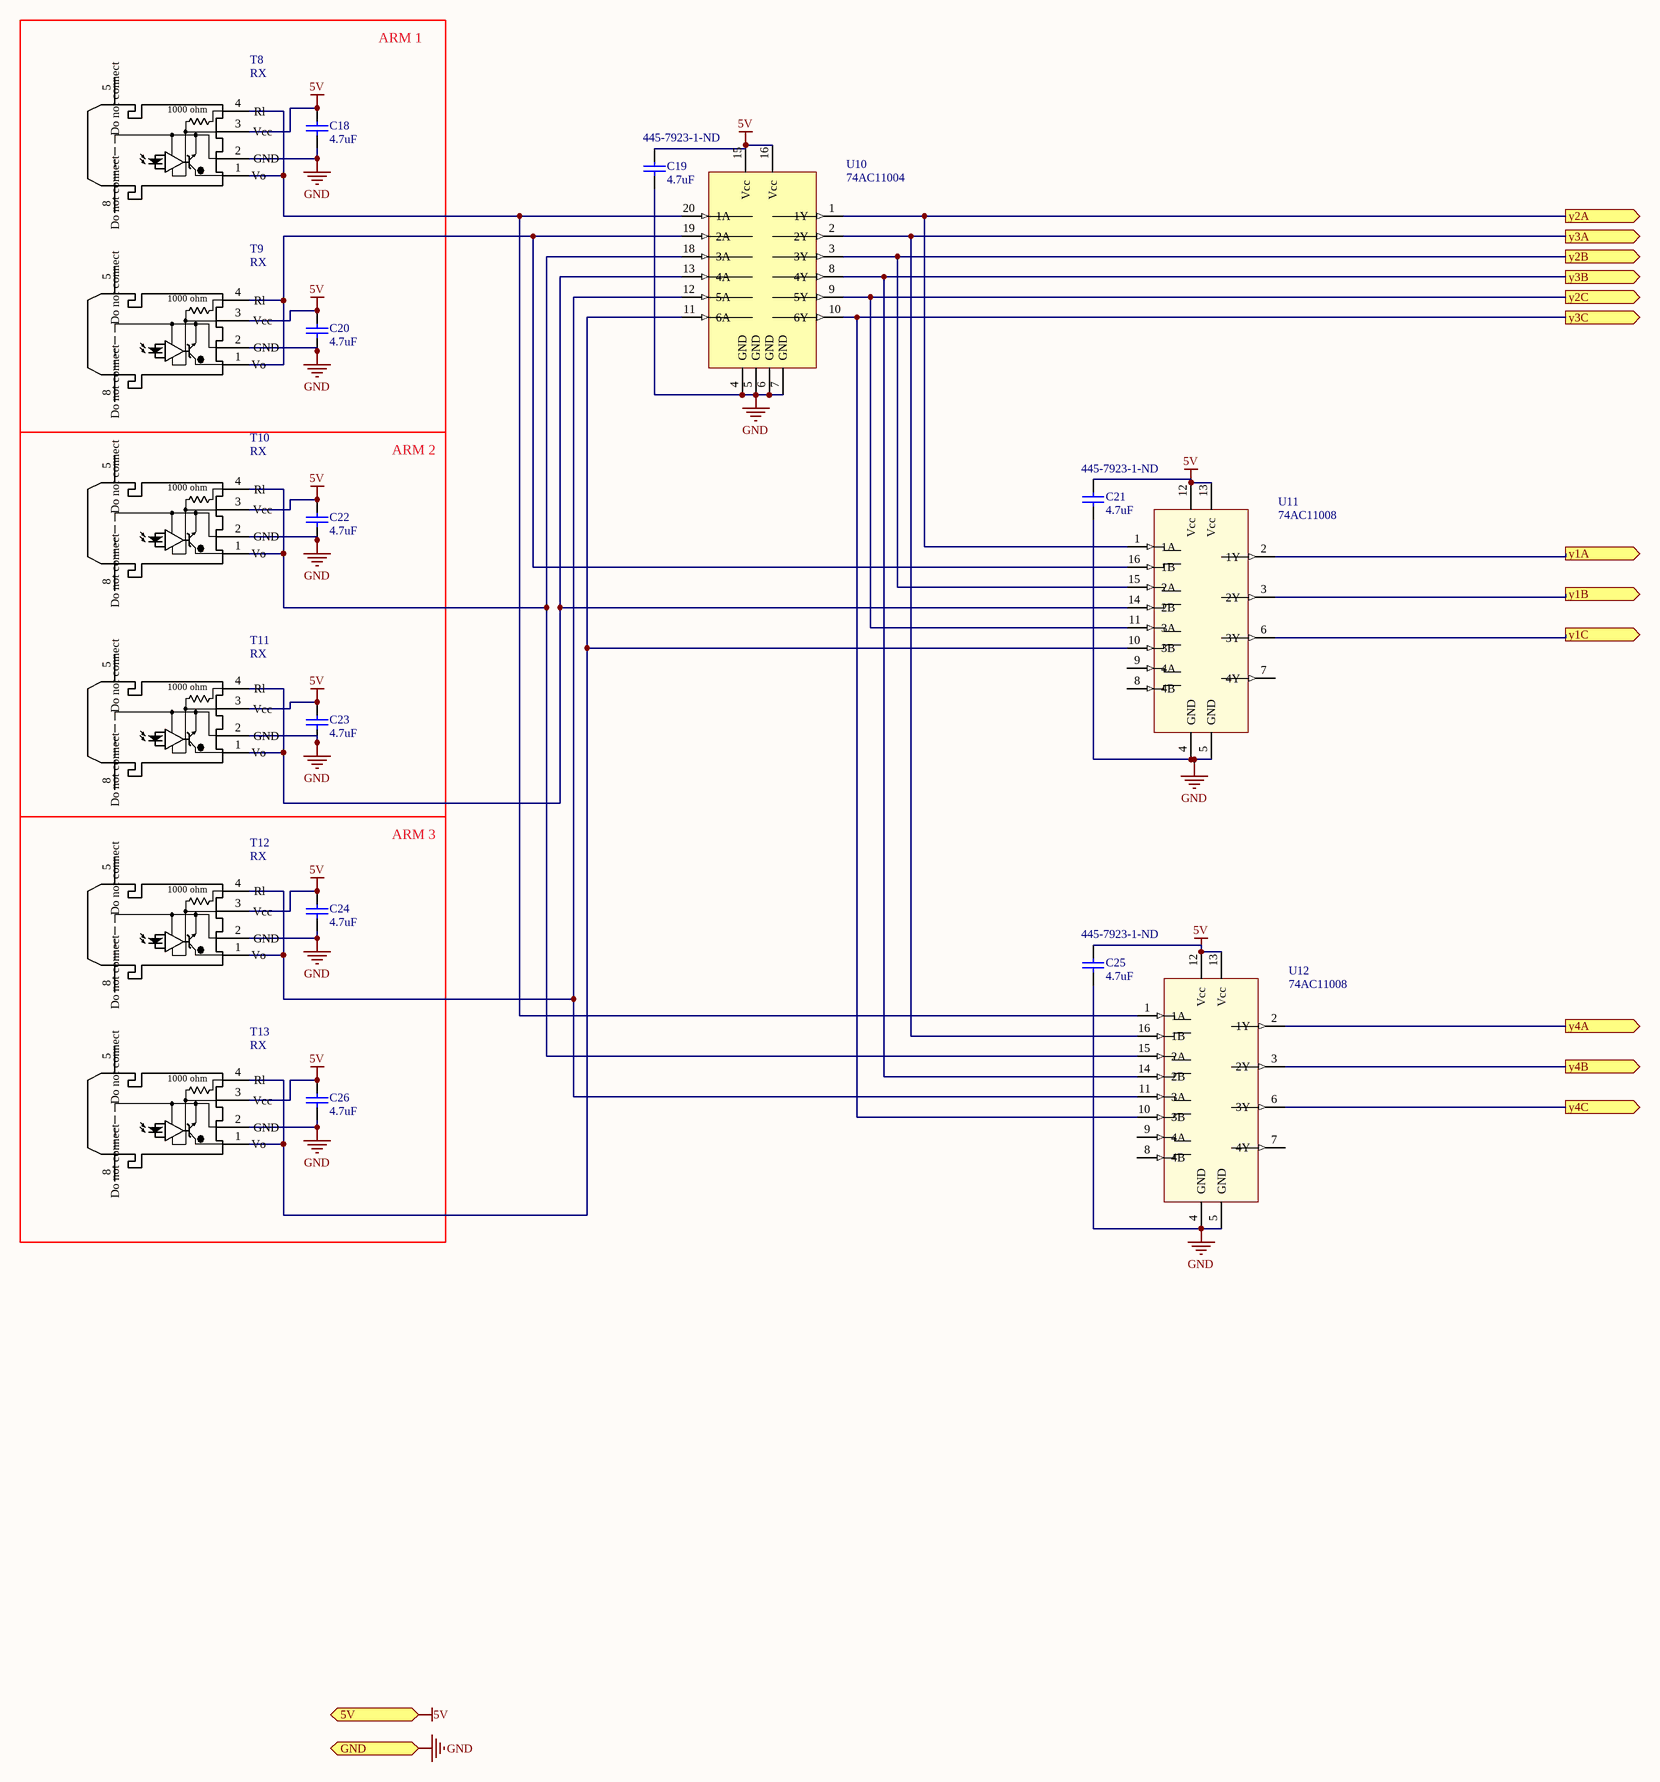
[diagram p3: Signals.SchDoc]

### Parts
C18  value 4.7uF  [C4532]  (hidden comment: Cap)
C19  value 4.7uF  Supplier Part Number 1: 445-7923-1-ND  [C4532]  (hidden comment: Cap)
C20  value 4.7uF  [C4532]  (hidden comment: Cap)
C21  value 4.7uF  Supplier Part Number 1: 445-7923-1-ND  [C4532]  (hidden comment: Cap)
C22  value 4.7uF  [C4532]  (hidden comment: Cap)
C23  value 4.7uF  [C4532]  (hidden comment: Cap)
C24  value 4.7uF  [C4532]  (hidden comment: Cap)
C25  value 4.7uF  Supplier Part Number 1: 445-7923-1-ND  [C4532]  (hidden comment: Cap)
C26  value 4.7uF  [C4532]  (hidden comment: Cap)
T8  RX  [Optics]
T9  RX  [Optics]
T10  RX  [Optics]
T11  RX  [Optics]
T12  RX  [Optics]
T13  RX  [Optics]
U10  74AC11004  [R-PDIP-T20]
U11  74AC11008  [R-PDIP-T16]
U12  74AC11008  [R-PDIP-T16]

### Blocks framed on the sheet
ARM 1: C18 C20 T8 T9
ARM 2: C22 C23 T10 T11
ARM 3: C24 C26 T12 T13

### Ports
5V, GND, y1A (out), y1B (out), y1C (out), y2A (out), y2B (out), y2C (out), y3A (out), y3B (out), y3C (out), y4A (out), y4B (out), y4C (out)

### Nets
5V: C18.2 C19.2 C20.2 C21.2 C22.2 C23.2 C24.2 C25.2 C26.2 T8.3(Vcc) T9.3(Vcc) T10.3(Vcc) T11.3(Vcc) T12.3(Vcc) T13.3(Vcc) U10.15(Vcc) U10.16(Vcc) U11.12(Vcc) U11.13(Vcc) U12.12(Vcc) U12.13(Vcc) ; port 5V
GND: C18.1 C19.1 C20.1 C21.1 C22.1 C23.1 C24.1 C25.1 C26.1 T8.2(GND) T9.2(GND) T10.2(GND) T11.2(GND) T12.2(GND) T13.2(GND) U10.4(GND) U10.5(GND) U10.6(GND) U10.7(GND) U11.4(GND) U11.5(GND) U12.4(GND) U12.5(GND) ; port GND
NetS1_13: U11.6(3Y) ; port y1C
NetS1_14: U10.10(6Y) U12.10(3B) ; port y3C
NetS1_15: U10.9(5Y) U11.11(3A) ; port y2C
NetS1_16: U12.6(3Y) ; port y4C
NetS1_17: U11.3(2Y) ; port y1B
NetS1_18: U10.8(4Y) U12.14(2B) ; port y3B
NetS1_19: U10.3(3Y) U11.15(2A) ; port y2B
NetS1_20: U12.3(2Y) ; port y4B
NetS1_21: U11.2(1Y) ; port y1A
NetS1_22: U10.2(2Y) U12.16(1B) ; port y3A
NetS1_23: U10.1(1Y) U11.1(1A) ; port y2A
NetS1_24: U12.2(1Y) ; port y4A
NetT8_1: T8.1(Vo) T8.4(Rl) U10.20(1A) U12.1(1A)
NetT9_1: T9.1(Vo) T9.4(Rl) U10.19(2A) U11.16(1B)
NetT10_1: T10.1(Vo) T10.4(Rl) U10.18(3A) U12.15(2A)
NetT11_1: T11.1(Vo) T11.4(Rl) U10.13(4A) U11.14(2B)
NetT12_1: T12.1(Vo) T12.4(Rl) U10.12(5A) U12.11(3A)
NetT13_1: T13.1(Vo) T13.4(Rl) U10.11(6A) U11.10(3B)

Not connected (* = marked no-connect by the designer): T8 5(Do_not_connect) 8(Do_not_connect); T9 5(Do_not_connect) 8(Do_not_connect); T10 5(Do_not_connect) 8(Do_not_connect); T11 5(Do_not_connect) 8(Do_not_connect); T12 5(Do_not_connect) 8(Do_not_connect); T13 5(Do_not_connect) 8(Do_not_connect); U11 7(4Y) 8(4B) 9(4A); U12 7(4Y) 8(4B) 9(4A)

### Notes on the sheet
- (in symbol HFBR-2524Z) 1000 ohm

### Library data of the parts
C18 C20 C22-C24 C26 = Cap: Capacitor; Published: 8-Jun-2000; LatestRevisionDate: 17-Jul-2002; LatestRevisionNote: Re-released for DXP Platform.; PackageReference: RAD-0.3; Publisher: Altium Limited; PackageDescription: Radial Cap, Thru-Hole; 2 Leads; 0.3 in Pin Spacing
C19 C21 C25 = Cap: as C2 on sheet Switches; Published: 8-Jun-2000; LatestRevisionDate: 17-Jul-2002; LatestRevisionNote: Re-released for DXP Platform.; PackageReference: RAD-0.3; Publisher: Altium Limited; PackageDescription: Radial Cap, Thru-Hole; 2 Leads; 0.3 in Pin Spacing; Supplier 1: Digi-Key; Stock 1: 0; Pricing 1: 1=1.92, 10=1.518, 100=1.1385 (USD); Case/Package: 1812; Weight: 0.000952oz; Case Code (Metric): 4532; Case Code (Imperial): 1812; Min Operating Temperature: -55°C; Max Operating Temperature: 125°C; Packaging: Tape and Reel; Package Quantity: 1; Capacitance: 4.7uF; Voltage Rating (DC): 100V; Termination: SMD/SMT; Composition: Ceramic; Length: 4.5mm; Height: 1.6mm; Width: 0.126inch; Thickness: 0.091inch; Depth: 3.2mm; REACH SVHC: No SVHC; ComponentLink1URL: https://datasheet.ciiva.com/24217/cga8n3x7s2a475k230kb-266118-24217101.pdf; ComponentLink1Description: https://datasheet.ciiva.com/24217/cga8n3x7s2a475k230kb-266118-24217101.pdf
T8-T13 = HFBR-2524Z: Optical Reciever
U10 = 74AC11004: Hex Inverter; Manufacturer: Texas Instruments; Manufacturer Part Number: 74AC11004N; Logic Function: Buffer,Inverter; Number of Elements: 6; Supply Voltage: 5V; Propagation Delay: 10ns; Max Supply Voltage: 5.5V; Min Supply Voltage: 3V; Number of Inputs: 1; Output Current: 24mA; Quiescent Current: 4uA; High Level Output Current: -24mA; Schmitt Trigger Input: No; Supplier 1: Digikey; Stock 1: 747; Pricing 1: 1=2.36, 10=2.12, 100=1.704, 500=1.4, 1000=1.16 (USD); Mount: Through Hole; Case/Package: PDIP; Number of Pins: 20; Weight: 0.042297oz; Contact Plating: Gold; Min Operating Temperature: -40°C; Max Operating Temperature: 85°C; Packaging: Rail/Tube; Package Quantity: 20; Number of Circuits: 6; Low Level Output Current: 24mA; Turn-On Delay Time: 10ns; Number of Gates: 6; Number of Bits: 6; Length: 26.92mm; Height: 4.57mm; Width: 6.6mm; Radiation Hardening: No; Lead Free: Lead Free; REACH SVHC: No SVHC; ComponentLink1URL: https://datasheet.ciiva.com/14289/74ac11004-14289990.pdf; ComponentLink1Description: https://datasheet.ciiva.com/14289/74ac11004-14289990.pdf; ComponentLink2URL: https://datasheet.ciiva.com/1869/74ac11004-1869911.pdf; ComponentLink2Description: https://datasheet.ciiva.com/1869/74ac11004-1869911.pdf; ComponentLink3URL: https://datasheet.ciiva.com/1157/1763878-1157128.pdf; ComponentLink3Description: https://datasheet.ciiva.com/1157/1763878-1157128.pdf; ComponentLink4URL: https://datasheet.ciiva.com/15089/getdatasheetpartid-371764-15089641.pdf; ComponentLink4Description: https://datasheet.ciiva.com/15089/getdatasheetpartid-371764-15089641.pdf; ComponentLink5URL: https://datasheet.ciiva.com/1153/1817335-1153741.pdf; ComponentLink5Description: https://datasheet.ciiva.com/1153/1817335-1153741.pdf; ComponentLink6URL: https://datasheet.ciiva.com/41426/001015348-da-01-en-ic-hex-inverter-7-74ac11004n-pdip-20-tid-41426322.pdf; ComponentLink6Description: https://datasheet.ciiva.com/41426/001015348-da-01-en-ic-hex-inverter-7-74ac11004n-pdip-20-tid-41426322.pdf; Supplier Part Number 1: 296-4153-5-ND
U11 U12 = 74AC11008: AND GATE; Manufacturer: Texas Instruments; Manufacturer Part Number: 74AC11008N; Number of Inputs: 2; Propagation Delay: 6.9ns; Min Supply Voltage: 3V; Max Supply Voltage: 5.5V; Number of Outputs: 1; Supply Voltage: 5V; Output Current: 24mA; Number of Circuits: 4; Quiescent Current: 4uA; High Level Output Current: -24mA; Schmitt Trigger Input: No; Supplier 1: Digikey; Stock 1: 236; Pricing 1: 1=2.36, 10=2.12, 100=1.704, 500=1.4, 1000=1.16 (USD); Mount: Through Hole; Case/Package: DIP; Number of Pins: 16; Weight: 0.03357oz; Contact Plating: Gold; Min Operating Temperature: -40°C; Max Operating Temperature: 85°C; Package Quantity: 25; Packaging: Rail/Tube; Logic Function: AND; Low Level Output Current: 24mA; Number of Gates: 4; Number of Elements: 4; Number of Input Lines: 2; Number of Output Lines: 1; Turn-On Delay Time: 6.9ns; Number of Bits: 4; Length: 19.69mm; Height: 4.57mm; Width: 6.6mm; Radiation Hardening: No; Lead Free: Lead Free; REACH SVHC: No SVHC; ComponentLink1URL: https://datasheet.ciiva.com/1869/74ac11008-1869907.pdf; ComponentLink1Description: https://datasheet.ciiva.com/1869/74ac11008-1869907.pdf; ComponentLink2URL: https://datasheet.ciiva.com/15215/getdatasheetpartid-541532-15215429.pdf; ComponentLink2Description: https://datasheet.ciiva.com/15215/getdatasheetpartid-541532-15215429.pdf; Supplier Part Number 1: 296-4154-5-ND

## Sheet DataOut.SchDoc
size A2
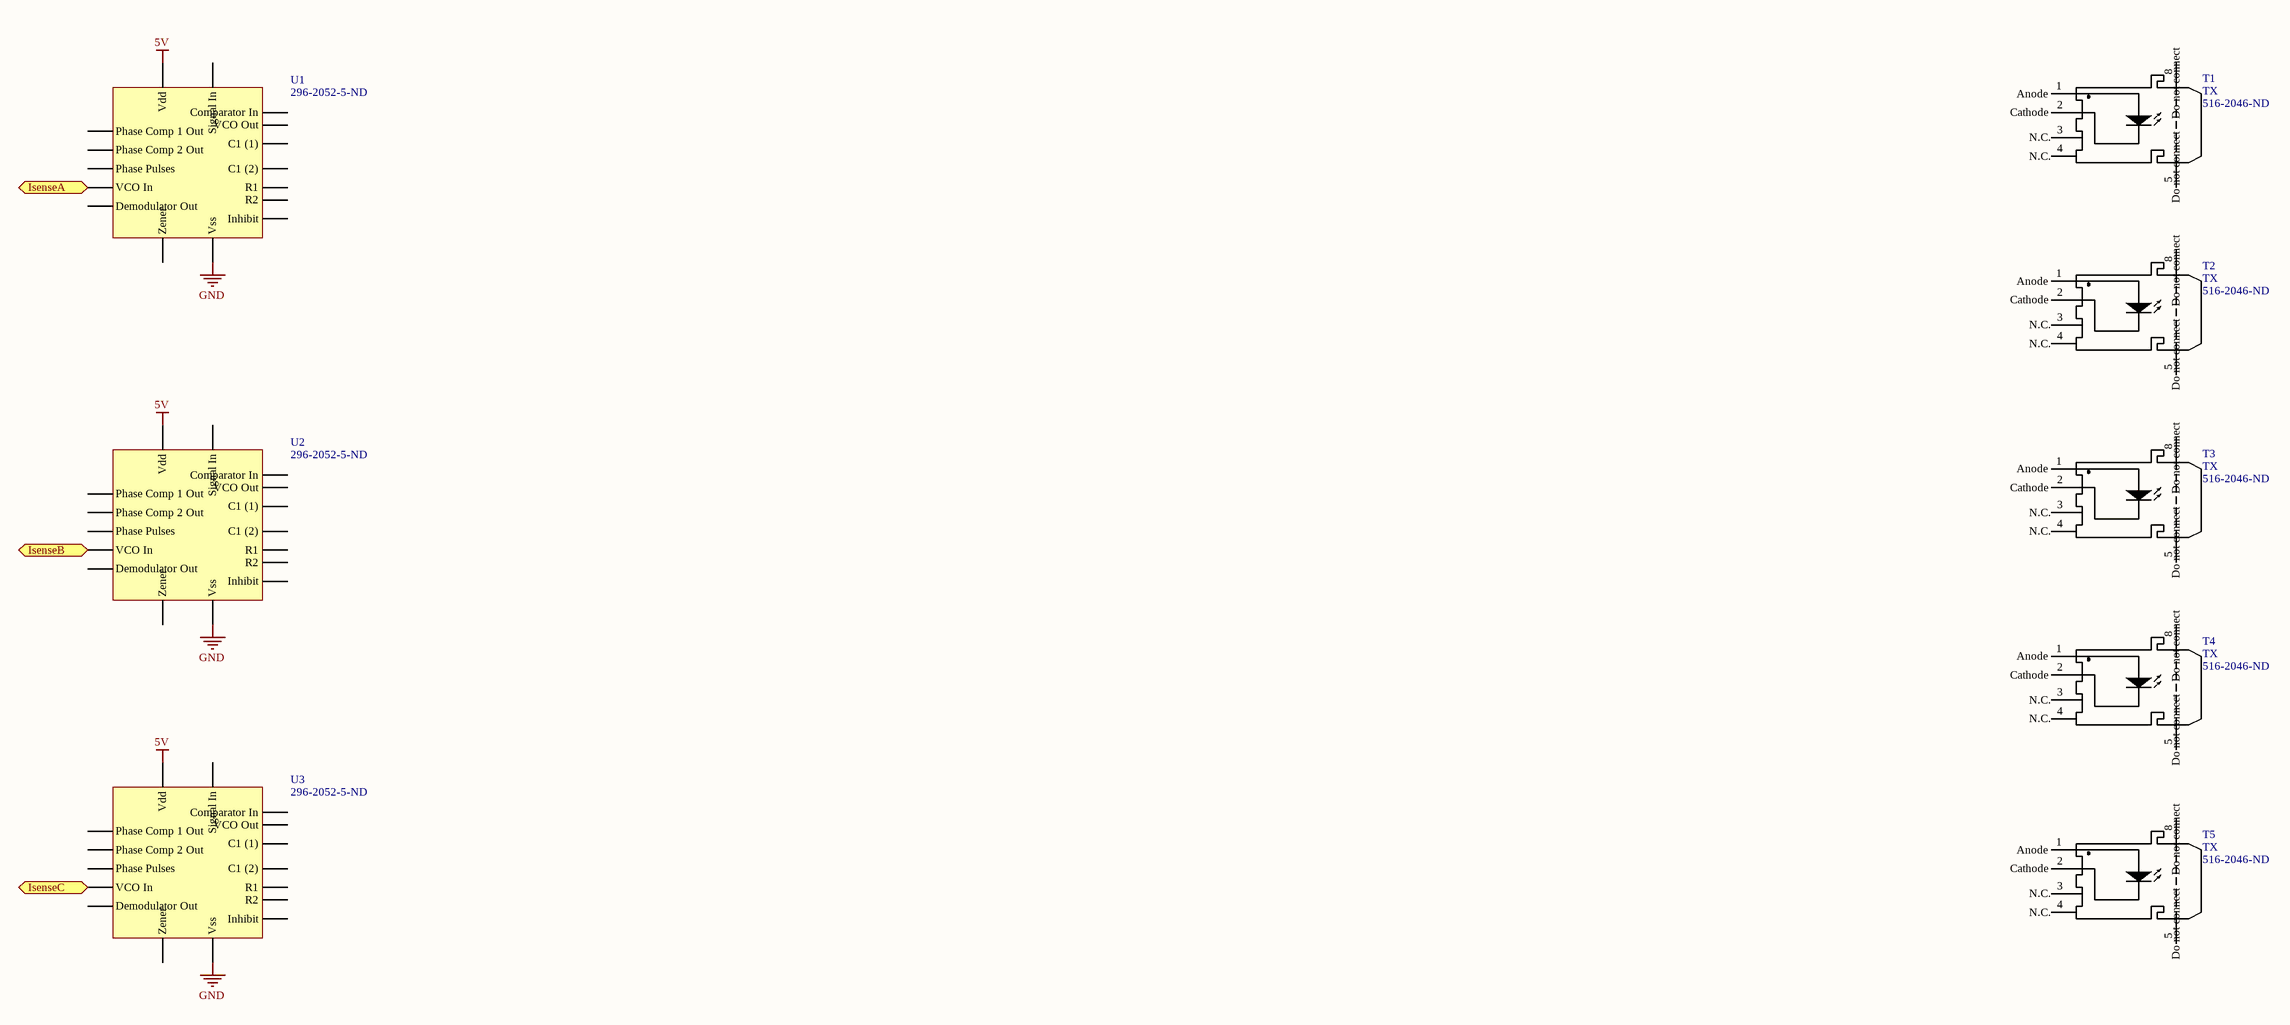
[diagram p4: DataOut.SchDoc]

### Parts
T1  TX  Supplier Part Number 1: 516-2046-ND  [Optics]
T2  TX  Supplier Part Number 1: 516-2046-ND  [Optics]
T3  TX  Supplier Part Number 1: 516-2046-ND  [Optics]
T4  TX  Supplier Part Number 1: 516-2046-ND  [Optics]
T5  TX  Supplier Part Number 1: 516-2046-ND  [Optics]
U1  Supplier Part Number 1: 296-2052-5-ND  [DIP16]  (hidden comment: CD4046B)
U2  Supplier Part Number 1: 296-2052-5-ND  [DIP16]  (hidden comment: CD4046B)
U3  Supplier Part Number 1: 296-2052-5-ND  [DIP16]  (hidden comment: CD4046B)

### Ports
IsenseA, IsenseB, IsenseC

### Nets
5V: U1.16(Vdd) U2.16(Vdd) U3.16(Vdd)
GND: U1.8(Vss) U2.8(Vss) U3.8(Vss)
NetU1_9: U1.9(VCO_In) ; port IsenseA
NetU2_9: U2.9(VCO_In) ; port IsenseB
NetU3_9: U3.9(VCO_In) ; port IsenseC

Not connected (* = marked no-connect by the designer): T1 1(Anode) 2(Cathode) 3(N.C.) 4(N.C.) 5(Do_not_connect) 8(Do_not_connect); T2 1(Anode) 2(Cathode) 3(N.C.) 4(N.C.) 5(Do_not_connect) 8(Do_not_connect); T3 1(Anode) 2(Cathode) 3(N.C.) 4(N.C.) 5(Do_not_connect) 8(Do_not_connect); T4 1(Anode) 2(Cathode) 3(N.C.) 4(N.C.) 5(Do_not_connect) 8(Do_not_connect); T5 1(Anode) 2(Cathode) 3(N.C.) 4(N.C.) 5(Do_not_connect) 8(Do_not_connect); U1 1(Phase_Pulses) 2(Phase_Comp_1_Out) 3(Comparator_In) 4(VCO_Out) 5(Inhibit) 6(C1_(1)) 7(C1_(2)) 10(Demodulator_Out) 11(R1) 12(R2) 13(Phase_Comp_2_Out) 14(Signal_In) 15(Zener); U2 1(Phase_Pulses) 2(Phase_Comp_1_Out) 3(Comparator_In) 4(VCO_Out) 5(Inhibit) 6(C1_(1)) 7(C1_(2)) 10(Demodulator_Out) 11(R1) 12(R2) 13(Phase_Comp_2_Out) 14(Signal_In) 15(Zener); U3 1(Phase_Pulses) 2(Phase_Comp_1_Out) 3(Comparator_In) 4(VCO_Out) 5(Inhibit) 6(C1_(1)) 7(C1_(2)) 10(Demodulator_Out) 11(R1) 12(R2) 13(Phase_Comp_2_Out) 14(Signal_In) 15(Zener)

### Library data of the parts
T1-T5 = HFBR-1524Z: Otical Transmitter; Manufacturer: Broadcom Avago; Wavelength: 660nm; Capacitance: 86pF; Forward Voltage: 1.67V; Data Rate: 1Mbps; Reverse Voltage (DC): 5V; Forward Current: 80mA; Max Output Current: 5.1mA; Rise Time: 80ns; Fall Time: 40ns; Supplier 1: Digikey; Manufacturer Part Number: HFBR-1524Z; Stock 1: 1574; Pricing 1: 1=11.66, 10=10.56, 25=8.36, 100=7.04, 250=6.6, 500=6.05, 1000=5.72 (USD); Mount: Through Hole; Case/Package: 600; Number of Pins: 6; Min Operating Temperature: -40°C; Max Operating Temperature: 85°C; Package Quantity: 200; Supply Voltage: 5V; Packaging: Rail/Tube; Length: 18.8mm; Height: 7.62mm; Width: 10.2mm; Radiation Hardening: No; REACH SVHC: No SVHC; Lead Free: Lead Free; ComponentLink1URL: https://datasheet.ciiva.com/27056/2062150-27056536.pdf; ComponentLink1Description: https://datasheet.ciiva.com/27056/2062150-27056536.pdf; ComponentLink2URL: https://datasheet.ciiva.com/18408/70158101-18408620.pdf; ComponentLink2Description: https://datasheet.ciiva.com/18408/70158101-18408620.pdf; ComponentLink3URL: https://datasheet.ciiva.com/26913/hfbr-1524z-26913686.pdf; ComponentLink3Description: https://datasheet.ciiva.com/26913/hfbr-1524z-26913686.pdf
U1-U3 = CD4046B: VCO; Manufacturer: Texas Instruments; Manufacturer Part Number: CD4046BE; Max Supply Voltage: 18V; Min Supply Voltage: 3V; Number of Elements: 1; Frequency: 2.4MHz; Nominal Supply Current: 10mA; Input: CMOS; PLL: Yes; Supplier 1: Digikey; Stock 1: 1216; Pricing 1: 1=0.56, 10=0.476, 100=0.3556, 500=0.2794, 1000=0.2159 (USD); Mount: Through Hole; Case/Package: DIP; Number of Pins: 16; Weight: 0.03357oz; Contact Plating: Gold; Min Operating Temperature: -55°C; Max Operating Temperature: 125°C; Packaging: Rail/Tube; Number of Circuits: 1; Number of Bits: 1; Package Quantity: 25; Max Frequency: 2.4MHz; Radiation Hardening: No; Lead Free: Lead Free; REACH SVHC: No SVHC; ComponentLink1URL: https://datasheet.ciiva.com/14134/cd4046b-eng-tds-14134658.pdf; ComponentLink1Description: https://datasheet.ciiva.com/14134/cd4046b-eng-tds-14134658.pdf; ComponentLink2URL: https://datasheet.ciiva.com/15153/getdatasheetpartid-241639-15153402.pdf; ComponentLink2Description: https://datasheet.ciiva.com/15153/getdatasheetpartid-241639-15153402.pdf; ComponentLink3URL: https://datasheet.ciiva.com/14247/cd4046b-14247052.pdf; ComponentLink3Description: https://datasheet.ciiva.com/14247/cd4046b-14247052.pdf; ComponentLink4URL: https://datasheet.ciiva.com/26229/cd4046b-mil-26229407.pdf; ComponentLink4Description: https://datasheet.ciiva.com/26229/cd4046b-mil-26229407.pdf; ComponentLink5URL: https://datasheet.ciiva.com/27050/817951-27050191.pdf; ComponentLink5Description: https://datasheet.ciiva.com/27050/817951-27050191.pdf; ComponentLink6URL: https://datasheet.ciiva.com/29297/172880-da-01-en-c-mos-ic-cd4046be-dip16-tid-29297245.pdf; ComponentLink6Description: https://datasheet.ciiva.com/29297/172880-da-01-en-c-mos-ic-cd4046be-dip16-tid-29297245.pdf

## Nets that join several sheets
5V: Main (8 pins), Signals (21 pins), DataOut (U1.16 U2.16 U3.16)
12V: Main (7 pins), A (C6_A.2 R3_A.2 U2_A.8 U5_A.8), B (C6_B.2 R3_B.2 U2_B.8 U5_B.8), C (C6_C.2 R3_C.2 U2_C.8 U5_C.8)
48V: Main (5 pins), A (12 pins), B (12 pins), C (12 pins)
GND: Main (41 pins), A (14 pins), B (14 pins), C (14 pins), Signals (23 pins), DataOut (U1.8 U2.8 U3.8)
Q1: A (P1_A.3 Q1_A#2.1 R4_A.2 R8_A.1), B (P1_B.3 Q1_B#2.1 R4_B.2 R8_B.1), C (P1_C.3 Q1_C#2.1 R4_C.2 R8_C.1)
Q2: A (P1_A.4 Q2_A#1.1 R6_A.2 R10_A.1), B (P1_B.4 Q2_B#1.1 R6_B.2 R10_B.1), C (P1_C.4 Q2_C#1.1 R6_C.2 R10_C.1)
Q3: A (P1_A.5 Q3_A#1.1 R5_A.2 R9_A.1), B (P1_B.5 Q3_B#1.1 R5_B.2 R9_B.1), C (P1_C.5 Q3_C#1.1 R5_C.2 R9_C.1)
Q4: A (P1_A.6 Q4_A#1.1 R16_A.2 R17_A#2.1), B (P1_B.6 Q4_B#1.1 R16_B.2 R17_B#2.1), C (P1_C.6 Q4_C#1.1 R16_C.2 R17_C#2.1)
SigGND: A (25 pins), B (25 pins), C (25 pins)
NetS1_13: Main (S1.13), Signals (U11.6)
NetS1_14: Main (S1.14), Signals (U10.10 U12.10)
NetS1_15: Main (S1.15), Signals (U10.9 U11.11)
NetS1_16: Main (S1.16), Signals (U12.6)
NetS1_17: Main (S1.17), Signals (U11.3)
NetS1_18: Main (S1.18), Signals (U10.8 U12.14)
NetS1_19: Main (S1.19), Signals (U10.3 U11.15)
NetS1_20: Main (S1.20), Signals (U12.3)
NetS1_21: Main (S1.21), Signals (U11.2)
NetS1_22: Main (S1.22), Signals (U10.2 U12.16)
NetS1_23: Main (S1.23), Signals (U10.1 U11.1)
NetS1_24: Main (S1.24), Signals (U12.2)